# Altium schematic sheet mcu.SchDoc
size A4; DocumentNumber: P22; SheetNumber: 2; SheetTotal: 5
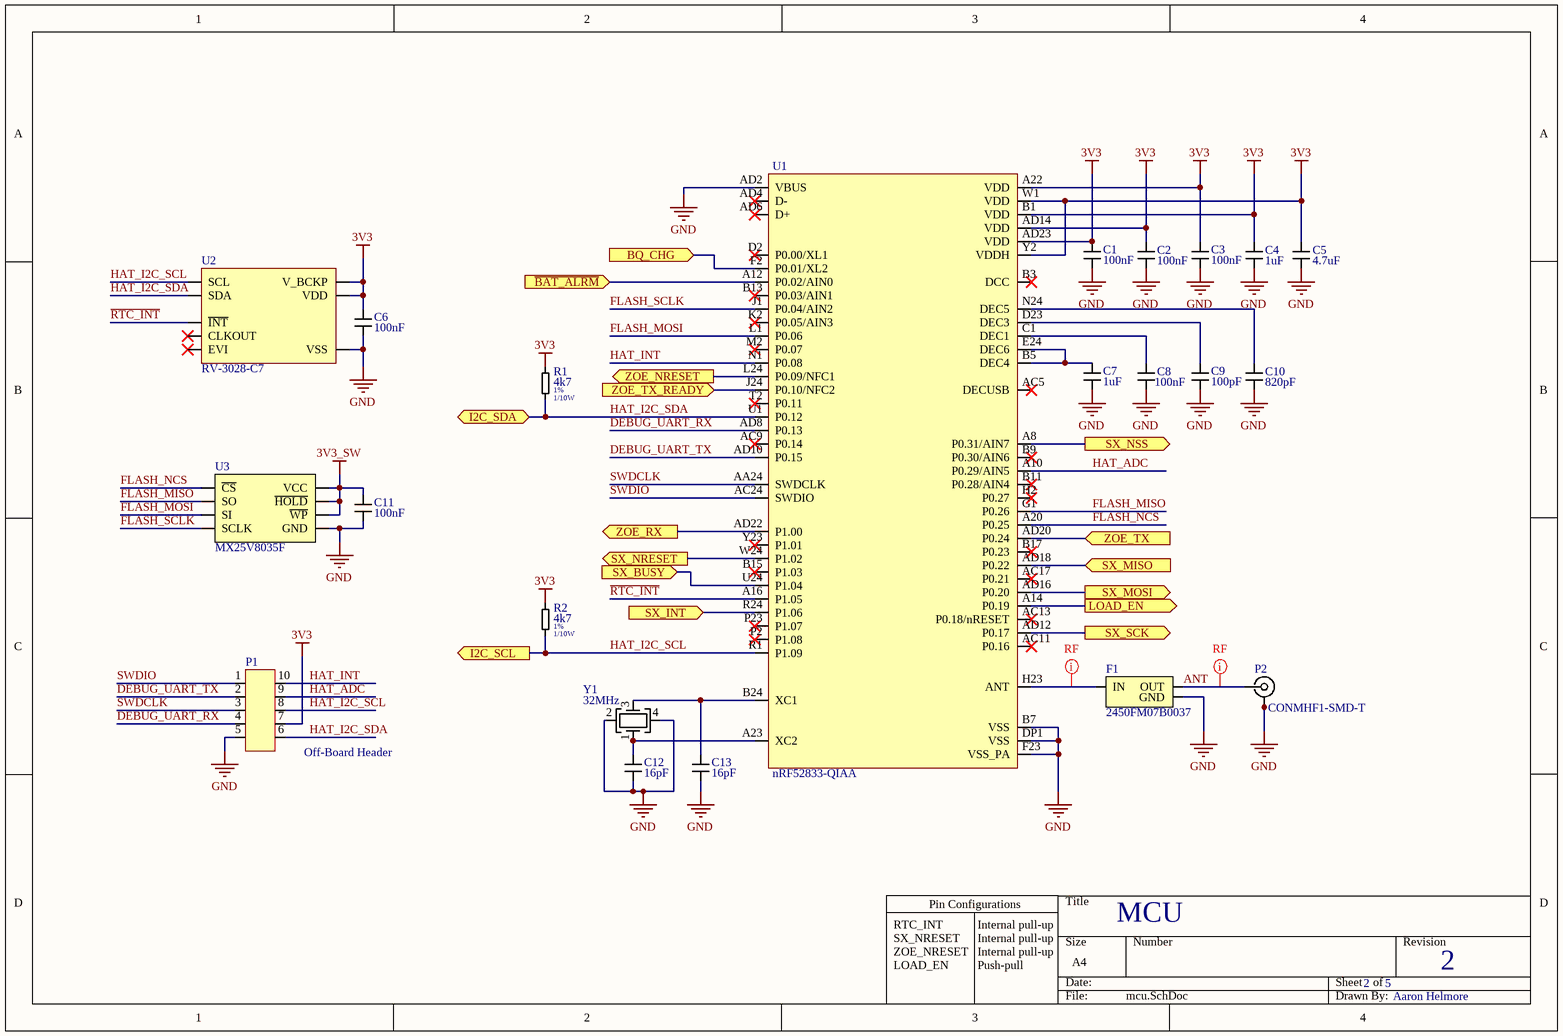
[diagram p0: mcu.SchDoc]

## Parts
C1  100nF  [CAP_0402]
C2  100nF  [CAP_0402]
C3  100nF  [CAP_0402]
C4  1uF  [CAP_0402]
C5  4.7uF  [CAP_0603]
C6  100nF  [CAP_0402]
C7  1uF  [CAP_0402]
C8  100nF  [CAP_0402]
C9  100pF  [CAP_0402]
C10  820pF  [CAP_0402]
C11  100nF  [CAP_0402]
C12  16pF  [CAP_0402]
C13  16pF  [CAP_0402]
F1  2450FM07B0037  [2450FM07B0037]
P1  Off-Board Header  [1_27-5x2-MALE-HEADER]
P2  CONMHF1-SMD-T  [CONMHF1-SMD-T]
R1  4k7  Tolerance: 1%  Wattage: 1/10W  [RES_0402]
R2  4k7  Tolerance: 1%  Wattage: 1/10W  [RES_0402]
U1  nRF52833-QIAA  [nRF52833-QIAA]
U2  RV-3028-C7  [RV-3028-C7]
U3  MX25V8035F  [MX25V8035F]
Y1  32MHz  [4-SMD]

## Ports
BQ_CHG (in), I2C_SCL (out), I2C_SDA (bidir), LOAD_EN (out), SX_BUSY (in), SX_INT (in), SX_MISO (in), SX_MOSI (out), SX_NRESET (out), SX_NSS (out), SX_SCK (out), ZOE_NRESET (out), ZOE_RX (out), ZOE_TX (in), ZOE_TX_READY (in), ~{BAT_ALRM} (in)

## Nets
3V3: C1.2(J11) C2.2(J11) C3.2(J11) C4.2(J11) C5.2(J11) C6.2(J11) P1.7 R1.1 R2.1 U1.A22(VDD) U1.AD14(VDD) U1.AD23(VDD) U1.B1(VDD) U1.W1(VDD) U1.Y2(VDDH) U2.6(V_BCKP) U2.7(VDD)
3V3_SW: C11.2(J11) U3.3(~{WP}) U3.7(~{HOLD}) U3.8(VCC)
GND: C1.1(J12) C2.1(J12) C3.1(J12) C4.1(J12) C5.1(J12) C6.1(J12) C7.1(J12) C8.1(J12) C9.1(J12) C10.1(J12) C11.1(J12) C12.1(J12) C13.1(J12) F1.2(GND) P1.5 P2.2(VCC) P2.3(VCC) P2.4(VCC) U1.AD2(VBUS) U1.B7(VSS) U1.DP1(VSS) U1.F23(VSS_PA) U2.5(VSS) U3.4(GND) Y1.2 Y1.4
ANT: F1.3(OUT) P2.1(VCC)
~{BAT_ALRM}: U1.A12(P0.02/AIN0) ; port ~{BAT_ALRM}
BQ_CHG: U1.F2(P0.01/XL2) ; port BQ_CHG
DEBUG_UART_RX: P1.4 U1.AD8(P0.13)
DEBUG_UART_TX: P1.2 U1.AD10(P0.15)
FLASH_MISO: U1.G1(P0.26) U3.2(SO)
FLASH_MOSI: U1.L1(P0.06) U3.5(SI)
FLASH_NCS: U1.A20(P0.25) U3.1(~{CS})
FLASH_SCLK: U1.J1(P0.04/AIN2) U3.6(SCLK)
HAT_ADC: P1.9 U1.A10(P0.29/AIN5)
HAT_I2C_SCL: P1.8 R2.2 U1.R1(P1.09) U2.3(SCL) ; port I2C_SCL
HAT_I2C_SDA: P1.6 R1.2 U1.U1(P0.12) U2.4(SDA) ; port I2C_SDA
HAT_INT: P1.10 U1.N1(P0.08)
LOAD_EN: U1.A14(P0.19) ; port LOAD_EN
~{RTC_INT}: U1.A16(P1.05) U2.2(~{INT})
SWDCLK: P1.3 U1.AA24(SWDCLK)
SWDIO: P1.1 U1.AC24(SWDIO)
SX_BUSY: U1.U24(P1.04) ; port SX_BUSY
SX_INT: U1.R24(P1.06) ; port SX_INT
SX_MISO: U1.AD18(P0.22) ; port SX_MISO
SX_MOSI: U1.AD16(P0.20) ; port SX_MOSI
SX_NRESET: U1.W24(P1.02) ; port SX_NRESET
SX_NSS: U1.A8(P0.31/AIN7) ; port SX_NSS
SX_SCK: U1.AD12(P0.17) ; port SX_SCK
ZOE_NRESET: U1.L24(P0.09/NFC1) ; port ZOE_NRESET
ZOE_RX: U1.AD22(P1.00) ; port ZOE_RX
ZOE_TX: U1.AD20(P0.24) ; port ZOE_TX
ZOE_TX_READY: U1.J24(P0.10/NFC2) ; port ZOE_TX_READY
NetC7_2: C7.2(J11) U1.B5(DEC4) U1.E24(DEC6)
NetC8_2: C8.2(J11) U1.C1(DEC1)
NetC9_2: C9.2(J11) U1.D23(DEC3)
NetC10_2: C10.2(J11) U1.N24(DEC5)
NetC12_2: C12.2(J11) U1.A23(XC2) Y1.1
NetC13_2: C13.2(J11) U1.B24(XC1) Y1.3
NetF1_1: F1.1(IN) U1.H23(ANT)

Not connected (* = marked no-connect by the designer): U1 AC5(DECUSB)* AC9(P0.14)* AC11(P0.16)* AC13(P0.18/nRESET)* AC17(P0.21)* AD4(D-)* AD6(D+)* B3(DCC)* B9(P0.30/AIN6)* B11(P0.28/AIN4)* B13(P0.03/AIN1)* B15(P1.03)* B17(P0.23)* D2(P0.00/XL1)* H2(P0.27)* K2(P0.05/AIN3)* M2(P0.07)* P2(P1.08)* P23(P1.07)* T2(P0.11)* Y23(P1.01)*; U2 1(CLKOUT)* 8(EVI)*

## Layout directives
rule Impedance Constraint [Min = 49.50    Max = 50.50    ]; net class NRF_RF_LINES: ANT, NetF1_1

## Notes on the sheet
- Pin Configurations
- RTC_INT
  SX_NRESET
  ZOE_NRESET
  LOAD_EN
- Internal pull-up
  Internal pull-up
  Internal pull-up
  Push-pull
- MCU
- 2
- 5
- Aaron Helmore

## Library data of the parts
C1-C4 C6-C8 C11 = Capacitor: Dielectric: X5R; Voltage: 25V
C5 = Capacitor: Dielectric: X5R; Voltage: 6.3V
C9 C10 C12 C13 = Capacitor: Dielectric: C0G; Voltage: 50V
F1 = 2450FM07B0037: Miniature 2.4GHz impedance matched low pass filter optimized for nRF52xxx
P1 = CONN_1-27_5x2: 1.27mm pitch 5x2 pin male connector
R1 R2 = R_Small
U1 = nRF52833-QIAA: BLE 5.1, Cortex M-4 SoC
U2 = RV-3028-C7: Extreme Low Power RTC Module
Y1 = Crystal_2_2